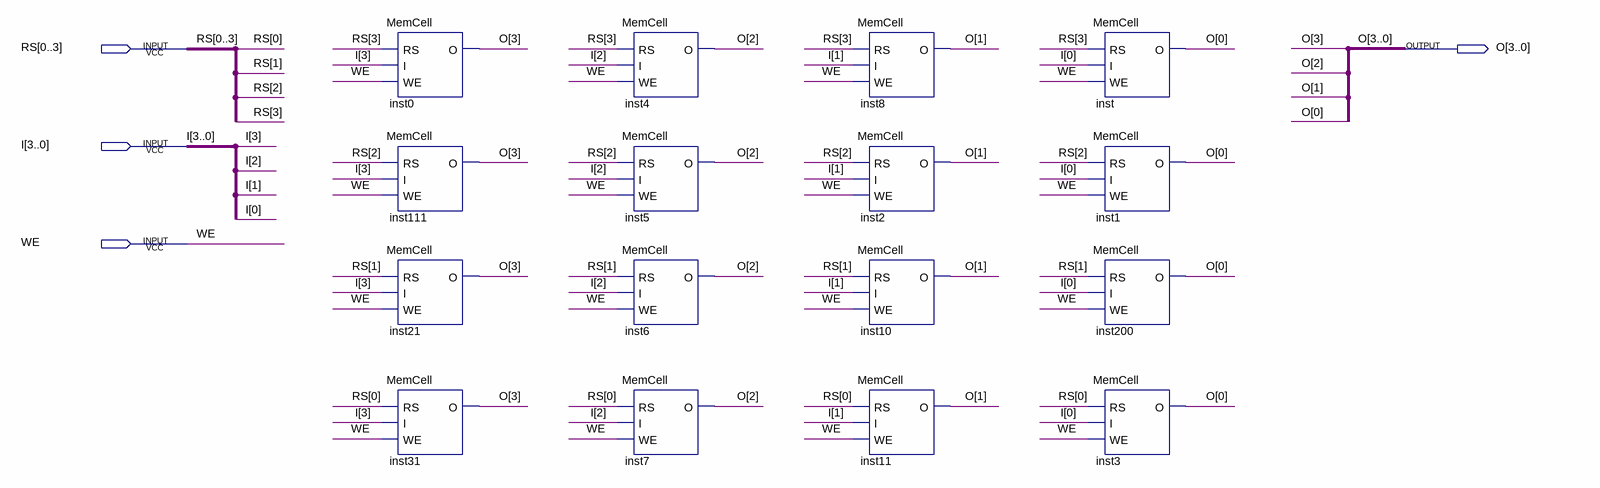
[diagram p0: schematic sheet]
// Quartus schematic 4x4MCell.bdf as structural Verilog: 16 symbols, 4 pins
module \4x4MCell  (
  input  [0:3] RS,
  input  [3:0] I,
  input  WE,
  output [3:0] O
);

  MemCell inst0 (.RS(RS[3]), .I(I[3]), .WE(WE), .O(O[3]));
  MemCell inst111 (.RS(RS[2]), .I(I[3]), .WE(WE), .O(O[3]));
  MemCell inst21 (.RS(RS[1]), .I(I[3]), .WE(WE), .O(O[3]));
  MemCell inst31 (.RS(RS[0]), .I(I[3]), .WE(WE), .O(O[3]));
  MemCell inst4 (.RS(RS[3]), .I(I[2]), .WE(WE), .O(O[2]));
  MemCell inst5 (.RS(RS[2]), .I(I[2]), .WE(WE), .O(O[2]));
  MemCell inst6 (.RS(RS[1]), .I(I[2]), .WE(WE), .O(O[2]));
  MemCell inst7 (.RS(RS[0]), .I(I[2]), .WE(WE), .O(O[2]));
  MemCell inst8 (.RS(RS[3]), .I(I[1]), .WE(WE), .O(O[1]));
  MemCell inst2 (.RS(RS[2]), .I(I[1]), .WE(WE), .O(O[1]));
  MemCell inst10 (.RS(RS[1]), .I(I[1]), .WE(WE), .O(O[1]));
  MemCell inst11 (.RS(RS[0]), .I(I[1]), .WE(WE), .O(O[1]));
  MemCell inst (.RS(RS[3]), .I(I[0]), .WE(WE), .O(O[0]));
  MemCell inst1 (.RS(RS[2]), .I(I[0]), .WE(WE), .O(O[0]));
  MemCell inst200 (.RS(RS[1]), .I(I[0]), .WE(WE), .O(O[0]));
  MemCell inst3 (.RS(RS[0]), .I(I[0]), .WE(WE), .O(O[0]));
endmodule
